# EAGLE design DAU_Kupplung_3phasig_V1_6 (EAGLE 6.1)
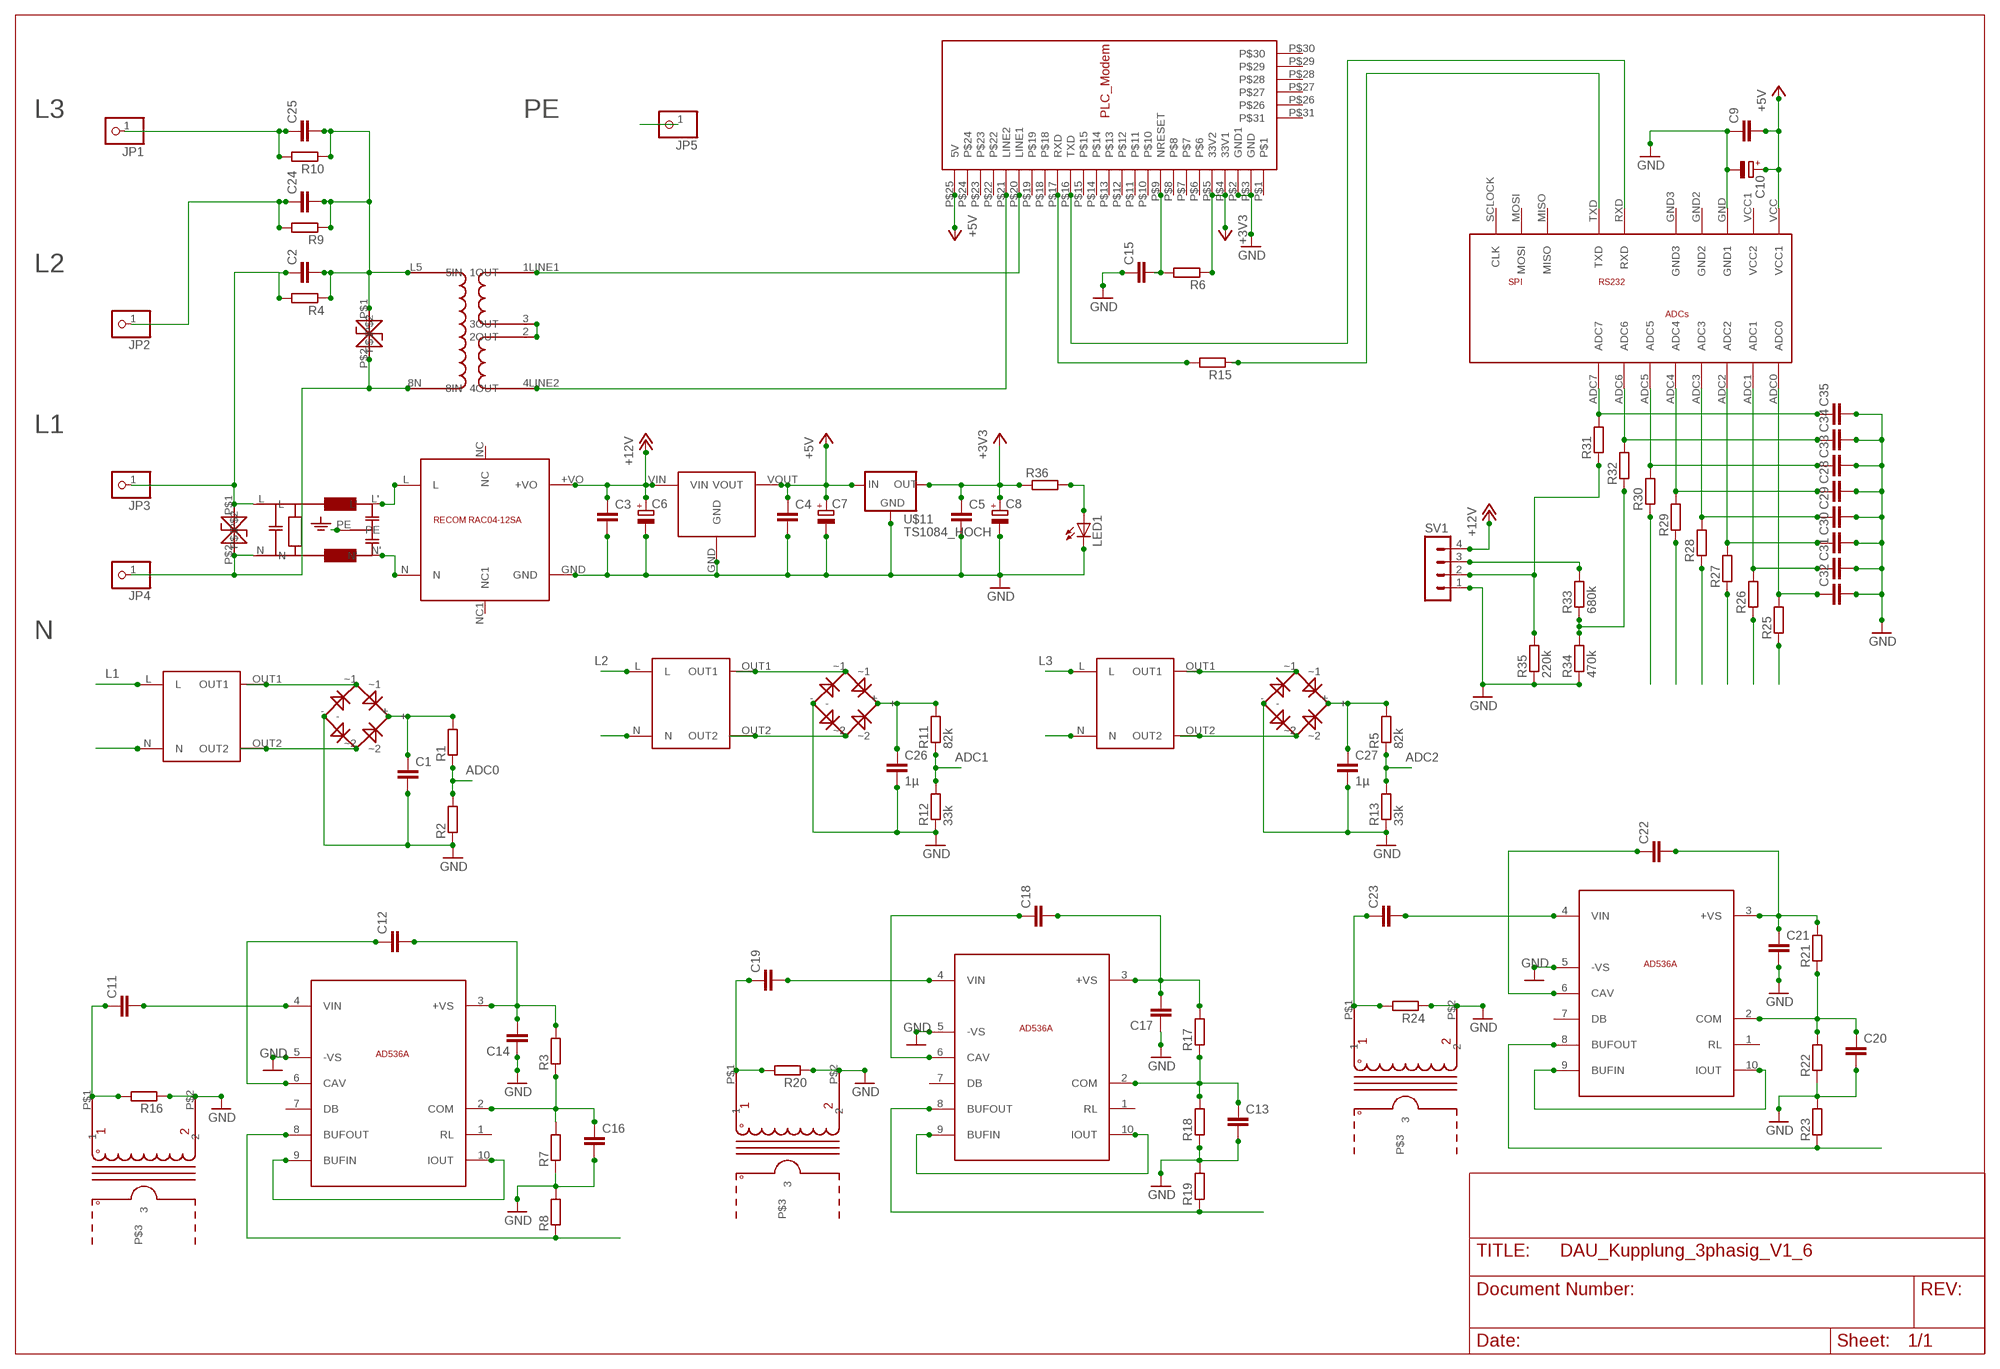
[diagram p0: schematic, sheet 1]

## Parts
AC1002_1  AC1010  [AC1010]
C1  C-EUC0805K  [C0805K]
C2  C-EU225-087X268  [C225-087X268]
C3  C-EUC0805K  [C0805K]
C4  C-EUC0805K  [C0805K]
C5  C-EUC0805K  [C0805K]
C6  CPOL-EUE2.5-6  [E2,5-6]
C7  CPOL-EUE2.5-6  [E2,5-6]
C8  CPOL-EUE2.5-6  [E2,5-6]
C9  C-EUC0805K  [C0805K]
C10  CPOL-EUE2,5-6E  [E2,5-6E]
C11  C-EUC0805K  [C0805K]
C12  C-EUC0805K  [C0805K]
C13  C-EUC0805K  [C0805K]
C14  C-EUC0805K  [C0805K]
C15  C-EUC0805K  [C0805K]
C16  C-EUC0805K  [C0805K]
C17  C-EUC0805K  [C0805K]
C18  C-EUC0805K  [C0805K]
C19  C-EUC0805K  [C0805K]
C20  C-EUC0805K  [C0805K]
C21  C-EUC0805K  [C0805K]
C22  C-EUC0805K  [C0805K]
C23  C-EUC0805K  [C0805K]
C24  C-EU225-087X268  [C225-087X268]
C25  C-EU225-087X268  [C225-087X268]
C26  1µ  C-EUC0805K  [C0805K]
C27  1µ  C-EUC0805K  [C0805K]
C28  C-EUC0805K  [C0805K]
C29  C-EUC0805K  [C0805K]
C30  C-EUC0805K  [C0805K]
C31  C-EUC0805K  [C0805K]
C32  C-EUC0805K  [C0805K]
C33  C-EUC0805K  [C0805K]
C34  C-EUC0805K  [C0805K]
C35  C-EUC0805K  [C0805K]
JP1  PINHD-1X1  [1X01]
JP2  PINHD-1X1  [1X01]
JP3  PINHD-1X1  [1X01]
JP4  PINHD-1X1  [1X01]
JP5  PINHD-1X1  [1X01]
LED1  LEDSQR2X5  [LED2X5]
R1  R-EU_R0805  [R0805]
R2  R-EU_R0805  [R0805]
R3  R-EU_R0805  [R0805]
R4  R-EU_0204/7  [0204/7]
R5  82k  R-EU_R0805  [R0805]
R6  R-EU_R0805  [R0805]
R7  R-EU_R0805  [R0805]
R8  R-EU_R0805  [R0805]
R9  R-EU_0204/7  [0204/7]
R10  R-EU_0204/7  [0204/7]
R11  82k  R-EU_R0805  [R0805]
R12  33k  R-EU_R0805  [R0805]
R13  33k  R-EU_R0805  [R0805]
R15  R-EU_R0805  [R0805]
R16  R-EU_0204/7  [0204/7]
R17  R-EU_R0805  [R0805]
R18  R-EU_R0805  [R0805]
R19  R-EU_R0805  [R0805]
R20  R-EU_0204/7  [0204/7]
R21  R-EU_R0805  [R0805]
R22  R-EU_R0805  [R0805]
R23  R-EU_R0805  [R0805]
R24  R-EU_0204/7  [0204/7]
R25  R-EU_R0805  [R0805]
R26  R-EU_R0805  [R0805]
R27  R-EU_R0805  [R0805]
R28  R-EU_R0805  [R0805]
R29  R-EU_R0805  [R0805]
R30  R-EU_R0805  [R0805]
R31  R-EU_R0805  [R0805]
R32  R-EU_R0805  [R0805]
R33  680k  R-EU_R0805  [R0805]
R34  470k  R-EU_R0805  [R0805]
R35  220k  R-EU_R0805  [R0805]
R36  R-EU_R0805  [R0805]
SV1  MA04-1  [MA04-1]
TSV1  TSV  [TSV]
TSV2  TSV  [TSV]
U$1  RECOM_RAC04_12SA  [RAC04_12SA]
U$2  SICHERHEITSTRAFO  [TRAFO_0,35VA]
U$3  ADUC831_MINIMUM  [ADUC_MINIMUM]
U$4  MODEMSTECKER  [MODEM_FUSS]
U$5  PLC_UEBERTRAGER_V2  [PLC-UEBERTRAGER_V2]
U$7  AC1010  [AC1010]
U$8  RECTIFIER  [RECTIFIER]
U$10  RECOM_785_05  [RECOM785X]
U$11  TS1084_HOCH  [TS1084_HOCH]
U$12  AD536  [TO100_10PIN]
U$13  AD536  [TO100_10PIN]
U$14  AC1010  [AC1010]
U$15  AD536  [TO100_10PIN]
U$16  SICHERHEITSTRAFO  [TRAFO_0,35VA]
U$17  RECTIFIER  [RECTIFIER]
U$18  SICHERHEITSTRAFO  [TRAFO_0,35VA]
U$19  RECTIFIER  [RECTIFIER]
U$20  NETZFILTER_05_A  [NETZFILTER]

## Nets
+3V3: C5.1 C8.+ R6.1 R36.1 U$4.P$4(33V1) U$4.P$5(33V2) U$11.OUT
+5V: C4.1 C7.+ C9.2 C10.+ U$3.VCC(VCC1) U$4.P$25(5V) U$10.VOUT U$11.IN
+12V: C3.1 C6.+ SV1.4 U$1.+VO U$10.VIN
ADC0: C32.1 R25.2 U$3.ADC0
ADC1: C31.1 R26.2 U$3.ADC1
ADC2: C30.1 R27.2 U$3.ADC2
ADC3: C29.1 R28.2 U$3.ADC3
ADC4: C28.1 R29.2 U$3.ADC4
ADC5: C33.1 R30.2 U$3.ADC5
GND: AC1002_1.P$2 C1.2 C3.2 C4.2 C5.2 C6.- C7.- C8.- C9.1 C10.- C13.2 C14.1 C15.1 C16.2 C17.1 C20.2 C21.2 C26.2 C27.2 C28.2 C29.2 C30.2 C31.2 C32.2 C33.2 C34.2 C35.2 LED1.K(C) R2.1 R7.1 R8.2 R12.1 R13.1 R16.1 R18.1 R19.2 R20.1 R22.1 R23.2 R24.1 R34.1 R35.1 SV1.1 U$1.GND U$3.GND(GND1) U$4.P$2(GND1) U$4.P$3(GND) U$7.P$2 U$8.- U$10.GND U$11.GND U$12.5(-VS) U$13.5(-VS) U$14.P$2 U$15.5(-VS) U$17.- U$19.-
I1: R8.1 R28.1 U$13.8(BUFOUT)
I2: R19.1 R29.1 U$12.8(BUFOUT)
I3: R23.1 R30.1 U$15.8(BUFOUT)
L1: C2.1 JP3.1 R4.2 TSV1.P$1 U$2.L U$20.L
L2: C24.1 JP2.1 R9.2 U$16.L
L3: C25.1 JP1.1 R10.2 U$18.L
N: JP4.1 TSV1.P$2 TSV2.P$2 U$2.N U$5.8N(8IN) U$16.N U$18.N U$20.N
N$1: R15.2 U$4.P$17(RXD)
N$2: AC1002_1.P$1 C11.1 R16.2
N$3: C11.2 U$13.4(VIN)
N$4: U$2.OUT1 U$8.~1
N$5: U$4.P$20(LINE1) U$5.1LINE1(1OUT)
N$6: U$13.9(BUFIN) U$13.10(IOUT)
N$7: C1.1 R1.2 U$8.+
N$8: C35.1 R31.2 U$3.ADC7
N$9: U$2.OUT2 U$8.~2
N$10: C26.1 R11.2 U$17.+
N$11: U$16.OUT1 U$17.~1
N$12: U$16.OUT2 U$17.~2
N$13: U$4.P$21(LINE2) U$5.4LINE2(4OUT)
N$14: R15.1 U$3.TXD
N$15: U$3.RXD U$4.P$16(TXD)
N$16: U$1.L U$20.L'
N$17: C16.1 R3.1 R7.2 U$13.2(COM)
N$18: C12.2 C14.2 R3.2 U$13.3(+VS)
N$19: LED1.A R36.2
N$20: C15.2 R6.2 U$4.P$9(NRESET)
N$21: C12.1 U$13.6(CAV)
N$22: C19.1 R20.2 U$7.P$1
N$23: C19.2 U$12.4(VIN)
N$24: U$12.9(BUFIN) U$12.10(IOUT)
N$25: C34.1 R32.2 U$3.ADC6
N$26: C2.2 C24.2 C25.2 R4.1 R9.1 R10.1 TSV2.P$1 U$5.L5(5IN)
N$27: C13.1 R17.1 R18.2 U$12.2(COM)
N$28: C17.2 C18.2 R17.2 U$12.3(+VS)
N$29: C18.1 U$12.6(CAV)
N$30: C23.1 R24.2 U$14.P$1
N$31: C23.2 U$15.4(VIN)
N$32: U$15.9(BUFIN) U$15.10(IOUT)
N$33: U$5.2(2OUT) U$5.3(3OUT)
N$34: C27.1 R5.2 U$19.+
N$35: U$18.OUT1 U$19.~1
N$36: U$18.OUT2 U$19.~2
N$37: R33.2 SV1.3
N$38: C20.1 R21.1 R22.2 U$15.2(COM)
N$39: C21.1 C22.2 R21.2 U$15.3(+VS)
N$40: C22.1 U$15.6(CAV)
N$41: U$1.N U$20.N'
N$49: R32.1 R33.1 R34.2
N$50: R31.1 R35.2 SV1.2
PE: JP5.1 U$20.PE
U1: R1.1 R2.2 R25.1
U2: R11.1 R12.2 R26.1
U3: R5.1 R13.2 R27.1
Unconnected: AC1002_1.P$3 U$1.NC U$1.NC1 U$3.GND2 U$3.GND3 U$3.MISO U$3.MOSI U$3.SCLOCK(CLK) U$3.VCC1(VCC2) U$4.P$1 U$4.P$6 U$4.P$7 U$4.P$8 U$4.P$10 U$4.P$11 U$4.P$12 U$4.P$13 U$4.P$14 U$4.P$15 U$4.P$18 U$4.P$19 U$4.P$22 U$4.P$23 U$4.P$24 U$4.P$26 U$4.P$27 U$4.P$28 U$4.P$29 U$4.P$30 U$4.P$31 U$7.P$3 U$12.1(RL) U$12.7(DB) U$13.1(RL) U$13.7(DB) U$14.P$3 U$15.1(RL) U$15.7(DB)

## Notes on the sheet
- L3 | PE
- L2
- L1
- N
- L2 | L3
- L1
- ADC1 | ADC2
- ADC0

## Library data of the parts
AC1002_1 U$7 U$14 = ADS:AC1010
C1-C5 C9 C11-C35 = resistor:C-EU: CAPACITOR, European symbol
C6-C8 = resistor:CPOL-EU: POLARIZED CAPACITOR, European symbol
C10 = rcl:CPOL-EU: POLARIZED CAPACITOR, European symbol
JP1-JP5 = pinhead:PINHD-1X1: PIN HEADER
LED1 = led:LED: LED OSRAM: - CHIPLED LG R971, LG N971, LY N971, LG Q971, LY Q971, LO R971, LY R971 LH N974, LH R974 LS Q976, LO Q976, LY Q976 LO Q996 - Hyper CHIPLED LW Q18S LB Q993, LB Q99A, LB R99A - SideLED LS A670, LO A670, LY A670, LG A670, LP A670 LB A673, LV A673, LT A673, LW A673 LH A674 LY A675 LS A676, LA A676, LO A676, LY A676, LW A676 LS A679, LY A679, LG A679 - Hyper Micro SIDELED® LS Y876, LA Y876, LO Y876, LY Y876 LT Y87S - SmartLED LW L88C, LW L88S LB L89C, LB L89S, LG L890 LS L89K, LO L89K, LY L89K LS L896, LA L896, LO L896, LY L896 - TOPLED LS T670, LO T670, LY T670, LG T670, LP T670 LSG T670, LSP T670, LSY T670, LOP T670, LYG T670 LG T671, LOG T671, LSG T671 LB T673, LV T673, LT T673, LW T673 LH T674 LS T676, LA T676, LO T676, LY T676, LB T676, LH T676, LSB T676, LW T676 LB T67C, LV T67C, LT T67C, LS T67K, LO T67K, LY T67K, LW E67C LS E67B, LA E67B, LO E67B, LY E67B, LB E67C, LV E67C, LT E67C LW T67C LS T679, LY T679, LG T679 LS T770, LO T770, LY T770, LG T770, LP T770 LB T773, LV T773, LT T773, LW T773 LH T774 LS E675, LA E675, LY E675, LS T675 LS T776, LA T776, LO T776, LY T776, LB T776 LHGB T686 LT T68C, LB T68C - Hyper Mini TOPLED® LB M676 - Mini TOPLED Santana® LG M470 LS M47K, LO M47K, LY M47K Source: http://www.osram.convergy.de LUXEON: - LUMILED® LXK2-PW12-R00, LXK2-PW12-S00, LXK2-PW14-U00, LXK2-PW14-V00 LXK2-PM12-R00, LXK2-PM12-S00, LXK2-PM14-U00 LXK2-PE12-Q00, LXK2-PE12-R00, LXK2-PE12-S00, LXK2-PE14-T00, LXK2-PE14-U00 LXK2-PB12-K00, LXK2-PB12-L00, LXK2-PB12-M00, LXK2-PB14-N00, LXK2-PB14-P00, LXK2-PB14-Q00 LXK2-PR12-L00, LXK2-PR12-M00, LXK2-PR14-Q00, LXK2-PR14-R00 LXK2-PD12-Q00, LXK2-PD12-R00, LXK2-PD12-S00 LXK2-PH12-R00, LXK2-PH12-S00 LXK2-PL12-P00, LXK2-PL12-Q00, LXK2-PL12-R00 Source: www.luxeon.com KINGBRIGHT: KA-3528ASYC Source: www.kingbright.com
R1-R13 R15-R36 = resistor:R-EU_: RESISTOR, European symbol
SV1 = con-lstb:MA04-1: PIN HEADER; OC_FARNELL: unknown; OC_NEWARK: unknown
TSV1 TSV2 = ADS:TSV
U$1 = ADS:RECOM_RAC04_12SA
U$2 U$16 U$18 = ADS:SICHERHEITSTRAFO
U$3 = ADS_ADUCBoards:ADUC831_MINIMUM
U$4 = ADS:MODEMSTECKER
U$5 = ADS1:PLC_UEBERTRAGER_V2
U$8 U$17 U$19 = ADS:RECTIFIER
U$10 = ADS:RECOM_785_05
U$11 = ADS:TS1084_HOCH
U$12 U$13 U$15 = ADS:AD536
U$20 = ADS:NETZFILTER_05_A

## Board
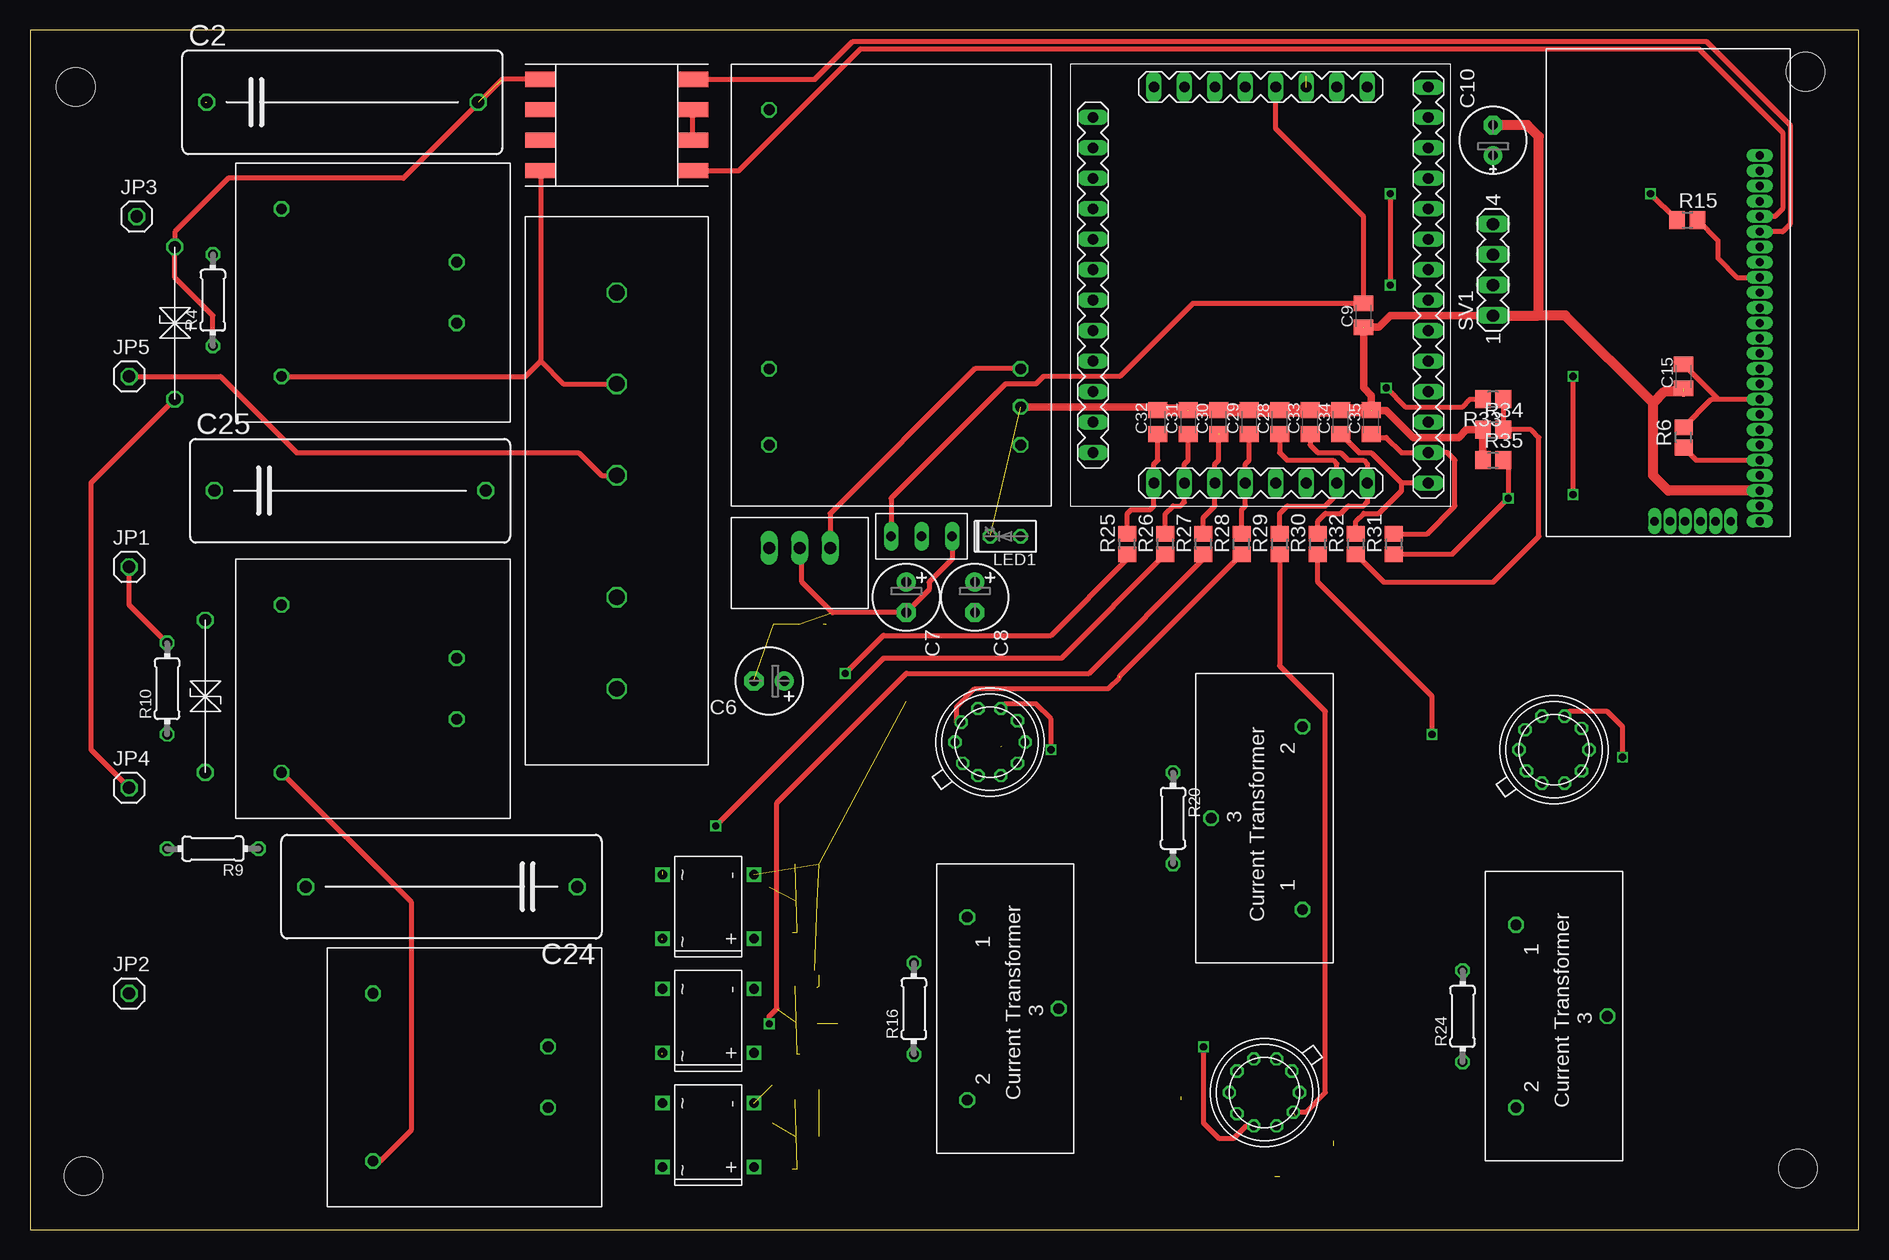
[diagram p1: board, top side]
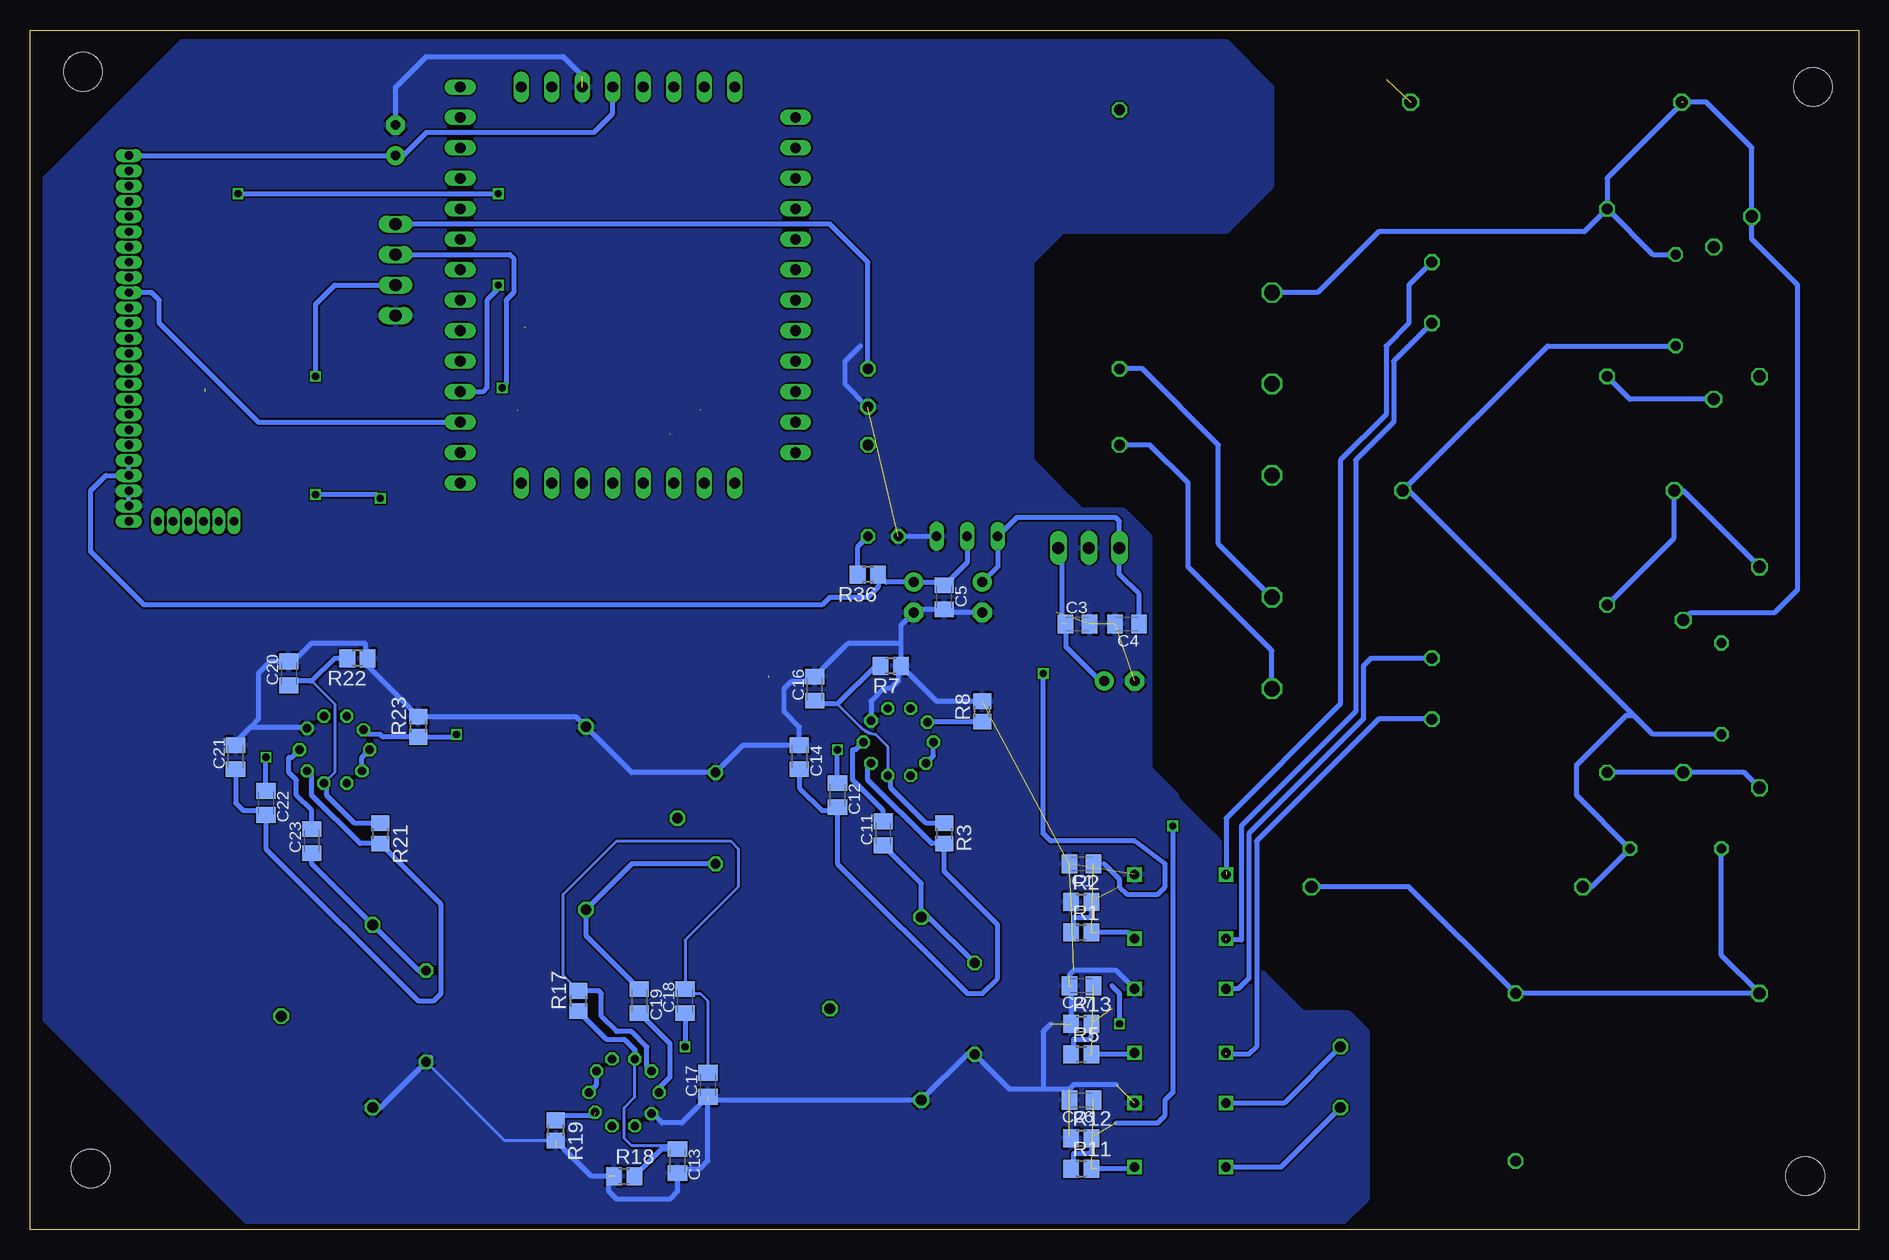
[diagram p2: board, bottom side, seen from below]

Size 152.38 x 100 mm. Coordinates in mm from the lower left corner, seen from the top.
Outline: 0,0 152.38,0 152.38,100 0,100 0,0
Copper layers (1*16): Top 0.035mm / dielectric 1.5mm / Bottom 0.035mm
Design rules: minimum track width 0.15mm, minimum drill 0.3mm, track to track 0.15mm, track to pad 0.15mm, pad to pad 0.15mm, via to via 0.15mm, smd to smd 0.15mm, copper to edge 0.3mm, drill to drill 0.2mm, minimum pad ring 0.2mm, minimum via ring 0.15mm, stop-mask expansion 0.075mm, vias tented up to drill 0mil, thermal gap 0.2mm
Holes 3.2 mm at 147.96,96.52 147.32,5.08 4.45,4.45 3.81,95.25

### Footprints (pad centres in the part's own frame; a part is rotated, then mirrored left to right if it is on the bottom)
AC1010 = drill 0.9 octagon: P$1 20.32,8.89; P$2 5.08,8.89; P$3 12.7,1.27
C0805K = smd 1.3 x 1.6: 1 -1,0; 2 1,0
C225-087X268 = drill 1.016 octagon: 1 -11.303,0; 2 11.303,0
E2,5-6 = drill 0.813 pad 1.6: + -1.27,0 | drill 0.813 pad 1.6 octagon: - 1.27,0
E2,5-6E = drill 0.813 pad 1.575: + -1.27,0 | drill 0.813 pad 1.575 octagon: - 1.27,0
1X01 = drill 1.016 octagon: 1 0,0
LED2X5 = drill 0.813 octagon: A -1.27,0; K 1.27,0
R0805 = smd 1.3 x 1.5: 1 -0.85,0; 2 0.85,0
0204/7 = drill 0.813 octagon: 1 -3.81,0; 2 3.81,0
MA04-1 = drill 1.016 long: 1 -3.81,0; 2 -1.27,0; 3 1.27,0; 4 3.81,0
TSV = drill 1 octagon: P$1 -5.08,0; P$2 7.62,0
RAC04_12SA = drill 0.9 octagon: +VO 25.4,24.13; GND 28.575,24.13; L 31.75,3.175; N 25.4,3.175; NC 3.81,3.175; NC1 31.75,24.13
TRAFO_0,35VA = drill 0.9 octagon: L 3.81,17.78; N 3.81,3.81; OUT1 18.415,13.335; OUT2 18.415,8.255
ADUC_MINIMUM = drill 0.9 long: ADC0 -9.207,-16.51; ADC1 -6.668,-16.51; ADC2 -4.128,-16.51; ADC3 -1.587,-16.51; ADC4 6.032,-16.51; ADC5 8.572,-16.51; ADC6 13.652,-16.51; ADC7 13.652,-13.97; ALE -14.287,6.35; DAC0 0.953,-16.51; DAC1 3.493,-16.51; GND 3.493,16.51; GND2 -4.128,16.51; GND3 -6.668,16.51; INT0 13.652,-6.35; MISO 13.652,-3.81; MOSI 13.652,11.43; P00 -14.287,3.81; P01 -14.287,1.27; P02 -14.287,-1.27; P03 -14.287,-3.81; P04 -14.287,-6.35; P05 -14.287,-8.89; P06 -14.287,-11.43; P07 -14.287,-13.97; P20 13.652,13.97; P21 13.652,16.51; P22 8.572,16.51; P23 6.032,16.51; P24 -9.207,16.51; P25 -14.287,13.97; P34 13.652,-1.27; P35 13.652,1.27; P36 13.652,3.81; P37 13.652,6.35; PWM0 -14.287,11.43; PWM1 -14.287,8.89; RXD 13.652,-11.43; SCLOCK 13.652,8.89; TXD 13.652,-8.89; VCC 0.953,16.51; VCC1 -1.587,16.51
MODEM_FUSS = drill 0.7 pad 0.813 long: P$1 -20.32,-8.89; P$2 -19.05,-8.89; P$3 -17.78,-8.89; P$4 -16.51,-8.89; P$5 -15.24,-8.89; P$6 -13.97,-8.89; P$7 -12.7,-8.89; P$8 -11.43,-8.89; P$9 -10.16,-8.89; P$10 -8.89,-8.89; P$11 -7.62,-8.89; P$12 -6.35,-8.89; P$13 -5.08,-8.89; P$14 -3.81,-8.89; P$15 -2.54,-8.89; P$16 -1.27,-8.89; P$17 0,-8.89; P$18 1.27,-8.89; P$19 2.54,-8.89; P$20 3.81,-8.89; P$21 5.08,-8.89; P$22 6.35,-8.89; P$23 7.62,-8.89; P$24 8.89,-8.89; P$25 10.16,-8.89; P$29 -20.32,-3.937; P$30 -20.32,-5.207; P$31 -20.32,-6.477 | drill 0.7 pad 0.61 long: P$26 -20.32,-0.127; P$27 -20.32,-1.397; P$28 -20.32,-2.667
PLC-UEBERTRAGER_V2 = smd 2.54 x 1.27: 1LINE1 6.35,3.81; 2 6.35,1.27; 3 6.35,-1.27; 4LINE2 6.35,-3.81; 6NC -6.35,1.27; 7NC -6.35,-1.27; 8N -6.35,-3.81; L5 -6.35,3.81
RECTIFIER = drill 0.8 square: + 6.858,7.62; - 1.524,7.62; ~1 1.524,0; ~2 6.858,0
RECOM785X = drill 1 long: GND 0,2.54; VIN -2.54,2.54; VOUT 2.54,2.54
TS1084_HOCH = drill 0.8 long: GND 0,0; IN 5.08,0; OUT 2.54,0
TO100_10PIN = drill 0.7 octagon: 1 2.794,-1.016; 2 2.794,0.889; 3 1.778,2.286; 4 0,2.921; 5 -1.778,2.286; 6 -2.794,0.889; 7 -2.794,-1.016; 8 -1.651,-2.413; 9 0,-2.921; 10 1.778,-2.286
NETZFILTER = drill 1.3 octagon: L 6.35,7.62; L' 39.37,7.62; N 13.97,7.62; N' 31.75,7.62; PE 21.59,7.62

### Placement (x,y rotation side)
AC1002_1  87,5.71 90 top
C1  64.77,30.48 180 bottom
C2  26.04,93.98 0 top
C3  65.09,50.48 0 bottom
C4  60.96,50.48 180 bottom
C5  76.2,52.7 270 bottom
C6  61.59,45.72 180 top
C7  73.03,52.7 270 top
C8  78.74,52.7 270 top
C9  111.12,76.2 90 top
C10  121.92,90.81 90 top
C11  81.28,33.02 90 bottom
C12  85.09,36.2 270 bottom
C13  98.42,5.71 270 bottom
C14  88.27,39.37 270 bottom
C15  137.79,71.12 90 top
C16  87,45.09 90 bottom
C17  95.89,12.06 90 bottom
C18  97.79,19.05 90 bottom
C19  101.6,19.05 270 bottom
C20  130.81,46.35 90 bottom
C21  135.25,39.37 90 bottom
C22  132.72,35.56 270 bottom
C23  128.91,32.38 90 bottom
C24  34.29,28.57 180 top
C25  26.67,61.59 0 top
C26  64.77,10.79 180 bottom
C27  64.77,20.32 180 bottom
C28  104.14,67.31 90 top
C29  101.6,67.31 90 top
C30  99.06,67.31 90 top
C31  96.52,67.31 90 top
C32  93.98,67.31 90 top
C33  106.68,67.31 90 top
C34  109.22,67.31 90 top
C35  111.76,67.31 90 top
JP1  8.26,55.24 0 top
JP2  8.26,19.68 0 top
JP3  8.89,84.45 0 top
JP4  8.26,36.83 0 top
JP5  8.26,71.12 0 top
LED1  81.28,57.78 180 top
R1  64.77,24.77 0 bottom
R2  64.77,27.3 0 bottom
R3  76.2,33.02 270 bottom
R4  15.24,77.47 90 top
R5  64.77,14.61 0 bottom
R6  137.79,66.04 90 top
R7  80.64,46.99 180 bottom
R8  73.03,43.18 90 bottom
R9  15.24,31.75 180 top
R10  11.43,45.09 90 top
R11  64.77,5.08 0 bottom
R12  64.77,7.62 0 bottom
R13  64.77,17.14 0 bottom
R15  138.11,84.14 0 top
R16  73.66,18.41 90 top
R17  106.68,19.05 90 bottom
R18  102.87,4.45 0 bottom
R19  108.58,8.26 270 bottom
R20  95.25,34.29 270 top
R21  123.19,33.02 270 bottom
R22  125.09,47.62 180 bottom
R23  120.02,41.91 90 bottom
R24  119.38,17.78 90 top
R25  91.44,57.15 90 top
R26  94.61,57.15 90 top
R27  97.79,57.15 90 top
R28  100.97,57.15 90 top
R29  104.14,57.15 90 top
R30  107.31,57.15 90 top
R31  113.67,57.15 90 top
R32  110.49,57.15 90 top
R33  121.92,69.22 180 top
R34  121.92,66.67 0 top
R35  121.92,64.14 0 top
R36  82.55,54.61 180 bottom
SV1  121.92,80.01 90 top
TSV1  14.61,45.72 270 top
TSV2  12.06,76.83 270 top
U$1  58.42,97.16 270 top
U$2  17.14,67.31 0 top
U$3  102.87,78.74 0 top
U$4  135.25,79.38 90 top
U$5  48.9,92.08 0 top
U$7  97.16,46.99 270 top
U$8  52.7,31.11 270 top
U$10  64.14,59.37 180 top
U$11  76.83,57.78 180 top
U$12  102.87,11.43 90 top
U$13  80.01,40.64 270 top
U$14  132.72,5.08 90 top
U$15  127,40.01 270 top
U$16  24.77,1.91 0 top
U$17  52.7,12.06 270 top
U$18  17.14,34.29 0 top
U$19  52.7,21.59 270 top
U$20  41.27,84.45 270 top

### Tracks (layer width: path | path; a pad name or v marks a point on that pad's centre or on a via)
+3V3
  Top 0.406: R6.1 138.85,64.14 U$4.P$5
  Bottom 0.406: U$11.OUT 74.3,55.61 C5.1 76.47,53.98 C8.+ 81.06,53.98 R36.1 81.7,53.55 82.55,52.7 85.72,52.7 86.36,52.07 142.88,52.07 147.32,56.52 147.32,61.59 146.05,62.87 U$4.P$4 U$4.P$5
+5V
  Top 0.406: U$3.VCC 103.82,91.76 111.12,84.45 C9.2 96.89,77.2 90.81,71.12 84.45,71.12 83.82,70.48 81.28,70.48 71.75,60.96 U$11.IN
  Bottom 0.406: U$4.P$25 C10.+ 121.28,89.53 119.38,91.44 105.41,91.44 103.82,93.03 U$3.VCC | C4.1 59.96,52.98 61.59,54.61 U$10.VOUT 61.59,59.05 61.91,59.37 70.17,59.37 U$11.IN 71.75,55.24 C7.+
+12V  (1 unrouted)
  Top 0.406: U$1.+VO 78.74,71.75 66.67,59.69 U$10.VIN
  Bottom 0.406: U$10.VIN 66.41,56.24 66.41,50.53 66.36,50.48 | U$1.+VO 82.55,80.64 85.72,83.82 SV1.4 | C6.+ 63.18,45.72 66.04,48.58 66.04,50.44 C3.1
ADC0
  Top 0.406: R25.2 91.44,59.69 91.76,60.01 93.34,60.01 93.66,60.33 U$3.ADC0 93.66,63.82 93.98,64.14 C32.1
ADC1
  Top 0.406: R26.2 94.61,59.69 95.25,60.33 95.89,60.33 96.2,60.64 U$3.ADC1 96.2,63.82 96.52,64.14 C31.1
ADC2  (1 unrouted)
  Top 0.406: R27.2 97.79,59.37 98.74,60.33 U$3.ADC2 98.74,63.82 99.06,64.14 99.06,66.36
ADC3
  Top 0.406: R28.2 100.97,60.01 101.28,60.33 U$3.ADC3 101.28,63.82 101.6,64.14 C29.1
ADC4
  Top 0.406: C28.1 104.14,64.77 104.78,64.14 108.58,64.14 108.9,63.82 U$3.ADC4 108.9,61.28 107.95,60.33 104.78,60.33 104.14,59.69 R29.2
ADC5
  Top 0.406: C33.1 106.68,65.41 107.31,64.77 109.22,64.77 109.86,64.14 111.12,64.14 111.44,63.82 U$3.ADC5 111.44,60.64 111.12,60.33 109.86,60.33 109.22,59.69 107.95,59.69 107.31,59.05 R30.2
GND  (22 unrouted)
  Top 0.406: U$10.GND 64.31,56.34 64.31,53.99 66.87,51.44 C7.- 74.93,53.34 74.93,53.98 76.83,55.88 U$11.GND | C32.2 93.71,68.58 | C15.1 137.43,70.48
  Top 0.61: 93.71,68.58 U$1.GND | R34.1 120.97,66.67 | 120.97,66.67 119.7,66.67 119.06,66.04 115.25,66.04 113.03,68.26 111.76,68.26 111.76,69.53 111.12,70.17 111.12,75.25 112.39,75.25 113.35,76.2 SV1.1 | R35.1 121.07,66.57 120.97,66.67
  Top 0.813: U$4.P$3 136.53,61.59 135.25,62.87 135.25,68.9 | 137.79,69.85 136.21,69.85 135.25,68.9 | 135.25,68.9 127.95,76.2 125.73,76.2 | 121.6,76.2 SV1.1 125.73,76.2 | 125.73,76.2 125.73,91.12 124.78,92.08 C10.-
  Top 1.016: C32.2 96.47,68.31 96.52,68.26 | C31.2 C30.2 C29.2 101.6,68.26 104.09,68.26 C28.2 104.14,68.26 106.63,68.26 C33.2 106.68,68.26 109.17,68.26 C34.2 C35.2
  Bottom 0.254: R19.2 112.81,7.41 R24.1 | C17.1 95.61,10.79
  Bottom 0.406: 61.85,12.06 65.41,12.06 65.77,11.7 67.94,11.7 | C7.- 75.93,51.44 C5.2 78.47,51.7 C8.- 79.8,50.38 79.8,48.9 | U$1.GND 84.45,70.48 84.45,72.39 83.19,73.66 | C10.- 121.92,95.25 119.38,97.79 107.95,97.79 106.36,96.2 | U$4.P$2 U$4.P$3 | U$11.GND LED1.K | U$14.P$2 123.19,10.16 R24.1 118.96,14.39 | C21.2 135.25,40.64 133.99,41.91 | 133.99,41.91 129.41,41.91 U$15.5 | 133.99,41.91 133.35,42.55 133.35,46.35 132.35,47.35 C20.2 130.44,47.35 128.91,48.9 124.46,48.9 124.46,47.84 R22.1 124.25,46.99 R23.2 106.89,42.76 U$7.P$2 102.23,38.1 R20.1 92.98,40.37 C14.1 88.27,41.91 89.53,43.18 89.53,45.09 88.9,45.72 87.36,45.72 C16.2 84.19,48.9 79.8,48.9 | R8.2 76.83,44.03 R7.1 | R7.1 79.8,48.9 | 67.94,11.7 70.75,11.7 R16.1 74.3,14.61 AC1002_1.P$2 95.89,10.79 | U$12.5 100.46,9.65 99.69,8.89 98.06,8.89 C17.1 95.89,5.71 96.52,5.08 98.06,5.08 C13.2 98.42,3.17 99.06,2.54 103.5,2.54 104.14,3.17 104.14,4.45 | R18.1 105.62,4.45 108.17,6.99 108.58,6.99 | R7.1 80.01,46.77 80.01,45.72 80.64,45.09 81.28,45.09 82.3,44.07 U$13.5 | 67.31,17.14 67.94,16.51 67.94,11.7 | 65.62,20.17 R13.1 | U$19.- 61.85,21.59 65.41,21.59 65.77,21.23 | R12.1 65.77,7.77
  pour Bottom: 44.45,0.64 134.3,0.64 151.13,17.46 151.13,87.63 147.96,90.81 139.7,99.06 52.7,99.06 48.9,95.25 48.9,87 52.7,83.19 66.36,83.19 68.9,80.64 68.9,64.14 66.67,61.91 64.77,60.01 61.28,60.01 59.37,58.1 59.05,57.78 59.05,38.42 56.83,36.2 56.83,35.88 49.85,28.89 49.85,21.59 46.35,18.1 42.55,18.1 40.96,16.51 40.96,2.54 42.86,0.64
I1  (1 unrouted)
  Top 0.406: R28.1 90.81,46.14 | U$13.8 77.22,42.29 77.22,43.56 78.74,45.09 89.85,45.09 90.81,46.04
  Bottom 0.406: R8.1 77.56,42.33 U$13.8
I2  (1 unrouted)
  Top 0.406: R29.1 104.14,46.99 107.95,43.18 107.95,11.43 106.3,9.78 U$12.8
  Bottom 0.406: R19.1 108.17,9.53 105.41,9.53 105.41,10.16
I3  (via drill 0.6)
  Top 0.406: v116.84,41.27 116.84,44.45 107.31,53.98 R30.1
  Bottom 0.406: U$15.8 124.21,41.27 123.19,41.27 122.97,41.06 R23.1 117.06,41.06 v116.84,41.27
L1  (1 unrouted)
  Bottom 0.406: U$2.L 20.95,87.63 14.61,93.98 12.7,93.98 8.89,90.17 JP3.1 8.89,82.55 5.08,78.74 5.08,53.34 6.99,51.44 13.97,51.44 TSV1.P$1 | U$2.L 17.14,81.28 R4.2 | U$2.L 22.86,83.19 40.01,83.19 45.09,78.11 U$20.L
L2
  Bottom 0.406: R9.2 11.43,22.86 JP2.1 U$16.L 37.47,28.57 C24.1
L3
  Top 0.406: R10.2 8.26,52.07 JP1.1
  Bottom 0.406: JP1.1 14.61,61.59 C25.1 15.37,57.66 U$18.L
N
  Top 0.406: U$5.8N 42.55,72.39 | 42.55,72.39 44.45,70.48 U$20.N | TSV2.P$2 5.08,62.23 5.08,40.01 JP4.1 | U$18.N 31.75,27.3 31.75,8.26 29.21,5.71 U$16.N | U$2.N 41.27,71.12 42.55,72.39
  Bottom 0.406: JP4.1 9.53,38.1 TSV1.P$2 U$18.N | TSV2.P$2 19.05,69.22 U$2.N
N$1
  Top 0.406: R15.2 140.65,82.45 140.65,80.96 142.24,79.38 U$4.P$17
N$2
  Bottom 0.406: C11.1 78.11,28.84 AC1002_1.P$1 77.47,26.04 R16.2
N$3
  Bottom 0.406: C11.2 81.28,34.92 83.82,37.47 83.82,40.01 83.57,40.01 U$13.4
N$4  (1 unrouted)
  Bottom 0.406: U$2.OUT1 37.47,78.74 37.47,75.56 39.37,73.66 39.37,67.94 43.18,64.14 43.18,43.81 52.7,34.29 52.7,29.84
N$5
  Top 0.406: U$5.1LINE1 65.41,95.89 68.58,99.06 139.7,99.06 146.69,92.08 146.69,83.82 146.05,83.19 U$4.P$20
N$6
  Bottom 0.406: U$13.10 77.09,39.5 U$13.9
N$7  (2 unrouted)
  Bottom 0.406: U$8.+ 60.83,24.77 63.5,24.77
N$8
  Top 0.406: C35.1 112.03,66.04 113.03,66.04 114.3,64.77 U$3.ADC7 118.11,64.77 118.75,64.14 118.75,60.33 116.42,58 R31.2
N$9  (1 unrouted)
  Bottom 0.406: U$2.OUT2 38.73,72.39 38.73,67.31 41.91,64.14 41.91,43.18 51.44,33.66 51.44,24.13 52.7,24.13
N$10  (2 unrouted)
  Bottom 0.406: U$17.+ 60.45,5.08 63.5,5.08
N$11
  Bottom 0.406: U$16.OUT1 47.88,10.54 U$17.~1
N$12
  Bottom 0.406: U$16.OUT2 48.13,5.21 U$17.~2
N$13
  Top 0.406: U$5.4LINE2 59.05,88.27 69.22,98.42 139.06,98.42 146.05,91.44 146.05,85.09 145.41,84.45 U$4.P$21
N$14  (via drill 0.6)
  Top 0.406: R15.1 v135.04,86.36 | v113.35,86.36 v113.35,78.74
  Bottom 0.406: v113.35,78.74 113.35,78.42 114.3,77.47 114.3,70.17 114.62,69.85 U$3.TXD | v135.04,86.36 v113.35,86.36
N$15
  Bottom 0.406: U$4.P$16 142.24,78.11 141.6,77.47 141.6,75.56 133.35,67.31 U$3.RXD
N$16
  Bottom 0.406: U$20.L' 48.9,48.26 55.88,55.24 55.88,62.23 59.05,65.41 U$1.L
N$17  (1 unrouted)
  Bottom 0.254: 80.9,40.26 U$13.2 | 85.09,43.81 83.19,41.91 arc-37 81.92,41.27 80.96,40.32
  Bottom 0.406: R7.2 81.92,46.99 85.09,43.81 86.72,43.81 C16.1 | R3.1 77.69,33.87 80.64,36.83 80.64,37.59 U$13.2
N$18
  Bottom 0.406: C14.2 88.27,36.83 86.36,34.92 85.36,34.92 C12.2 85.09,30.48 74.3,19.68 73.03,19.68 71.75,20.95 71.75,25.4 76.2,29.84 R3.2 77.25,32.17 82.55,37.47 82.55,38.61 U$13.3
N$19
  Bottom 0.406: R36.2 83.4,56.94 LED1.A
N$20
  Top 0.406: C15.2 140.7,69.22 | 140.7,69.22 U$4.P$9 | R6.2 140.12,69.22 140.7,69.22
N$21  (via drill 0.6)
  Top 0.406: v85.09,40.01 85.09,42.55 83.82,43.81 81.28,43.81 U$13.6
  Bottom 0.406: C12.1 v85.09,40.01
N$22
  Bottom 0.406: R20.2 102.23,30.48 U$7.P$1 106.05,24.5 C19.1
N$23
  Bottom 0.406: C19.2 99.06,15.51 99.06,12.7 99.95,11.81 U$12.4
N$24
  Bottom 0.406: U$12.9 105.16,12.06 U$12.10
N$25
  Top 0.406: C34.1 110.76,64.77 111.76,64.77 114.14,62.39 114.3,62.23 | R32.2 110.49,59.05 111.12,59.69 112.39,59.69 114.3,61.59 114.3,62.23 | U$3.ADC6 114.3,62.23
N$26  (1 unrouted)
  Top 0.406: U$5.L5 39.37,95.89 31.11,87.63 16.51,87.63 12.06,83.19 TSV2.P$1 12.06,79.38 15.24,76.2 R4.1
  Bottom 0.406: R4.1 25.91,73.66 C25.2 37.47,61.59 18.73,42.86 | R10.1 17.14,41.27 18.73,42.86 | C24.2 22.23,28.57 R9.1 23.5,36.2 23.5,38.73 19.37,42.86 18.73,42.86
N$27
  Bottom 0.254: C13.1 98.69,6.99 102.23,6.99 102.87,7.62 102.87,10.16 101.98,11.05 U$12.2
  Bottom 0.406: R18.2 99.75,6.71 C13.1 | R17.1 104.36,15.88 102.87,15.88 101.98,14.99 U$12.2
N$28
  Bottom 0.254: R17.2 107.95,21.17 107.95,27.94 103.5,32.38 93.98,32.38 93.34,31.75 93.34,28.57 97.79,24.13 C18.2 | C18.2 97.79,19.68 | C18.2 97.42,19.68 96.52,19.68 95.89,19.05 C17.2
  Bottom 0.406: C18.2 98.16,19.68 | C17.2 96.03,13.21 | U$12.3 100.97,13.59 100.97,15.24 102.23,16.51 103.5,16.51 104.78,17.78 104.78,19.68 104.99,19.9 R17.2
N$29  (via drill 0.6)
  Top 0.406: v97.79,15.24 97.79,8.89 99.06,7.62 100.33,7.62 101.35,8.64 U$12.6
  Bottom 0.406: C18.1 v97.79,15.24
N$30
  Bottom 0.406: R24.2 120.02,21.59 U$14.P$1 128.91,30.48 C23.1
N$31
  Bottom 0.406: C23.2 128.91,34.92 130.18,36.2 130.18,37.47 130.81,38.1 130.81,39.37 130.56,39.37 U$15.4
N$32
  Bottom 0.406: U$15.10 124.71,39.37 U$15.9
N$33
  Top 0.406: U$5.3 U$5.2
N$34  (2 unrouted)
  Bottom 0.406: U$19.+ 60.45,14.61 64.14,14.61
N$35
  Bottom 0.406: U$18.OUT1 40.64,47.62 41.27,46.99 41.27,42.55 50.8,33.02 50.8,20.95 51.69,20.07 U$19.~1
N$36  (1 unrouted)
  Bottom 0.406: U$18.OUT2 40.01,42.55 50.16,32.38 50.16,15.24 50.8,14.61 52.7,14.61
N$37  (via drill 0.6)
  Top 0.406: v113.03,70.17 114.62,68.58 119.38,68.58 120.02,69.22 R33.2
  Bottom 0.406: SV1.3 112.39,81.28 112.08,80.96 112.08,78.11 112.71,77.47 112.71,70.48 v113.03,70.17
N$38
  Bottom 0.254: U$15.2 127,38.1 127,43.81 128.54,45.35 128.91,45.72
  Bottom 0.406: R21.1 125.31,33.87 127.64,36.2 127.64,36.96 U$15.2 | R22.2 127,47.62 128.91,45.72 130.44,45.72 C20.1
N$39
  Bottom 0.406: C21.1 135.25,35.56 134.62,34.92 133.08,34.92 C22.2 132.72,31.75 120.02,19.05 118.75,19.05 118.11,19.68 118.11,27.09 R21.2 124.88,32.17 128.91,36.2 128.91,37.85 U$15.3
N$40  (via drill 0.6)
  Top 0.406: v132.72,39.37 132.72,41.91 131.44,43.18 128.27,43.18 U$15.6
  Bottom 0.406: C22.1 v132.72,39.37
N$41
  Bottom 0.406: U$20.N' 53.34,57.15 53.34,65.41 59.69,71.75 U$1.N
N$49
  Top 0.406: R32.1 112.81,53.98 121.92,53.98 125.73,57.78 125.73,66.04 125.09,66.67 R34.2 R33.1
N$50  (via drill 0.6)
  Top 0.406: R31.1 118.53,56.3 v123.19,60.96 123.19,63.72 R35.2 | v128.59,61.28 v128.59,71.12
  Bottom 0.406: v123.19,60.96 123.51,61.28 v128.59,61.28 | v128.59,71.12 128.59,77.15 127,78.74 SV1.2
PE
  Top 0.406: JP5.1 15.88,71.12 22.23,64.77 45.72,64.77 47.62,62.87 U$20.PE
U1  (via drill 0.6)  (1 unrouted)
  Top 0.406: v67.94,46.35 71.12,49.53 85.09,49.53 91.44,55.88 R25.1
  Bottom 0.406: R1.1 65.41,24.98 65.41,26.04 64.14,26.04 63.92,26.25 R2.2 63.77,27.45 | 62.87,30.48 61.59,29.21 61.59,28.57 60.96,27.94 58.42,27.94 57.78,28.57 57.78,30.48 60.33,32.38 67.31,32.38 67.94,33.02 v67.94,46.35
U2  (via drill 0.6)  (1 unrouted)
  Top 0.406: R26.1 85.94,47.62 71.12,47.62 v57.15,33.66
  Bottom 0.406: R11.1 65.41,5.29 65.41,6.35 64.14,6.35 63.92,6.57 R12.2 63.77,7.77 | 61.87,8.89 58.42,8.89 57.78,9.53 57.78,10.79 57.15,11.43 v57.15,33.66
U3  (via drill 0.6)  (1 unrouted)
  Top 0.406: R27.1 97.79,55.88 88.27,46.35 73.03,46.35 62.23,35.56 62.23,18.41 61.59,17.78 v61.59,17.14
  Bottom 0.406: R5.1 65.41,14.82 65.41,15.88 64.14,15.88 63.92,16.09 R13.2 63.77,17.3 | 62.23,20.32 61.59,19.68 v61.59,17.14